# Altium schematic sheet Power.SchDoc
size A4; SheetNumber: 2; SheetTotal: 6
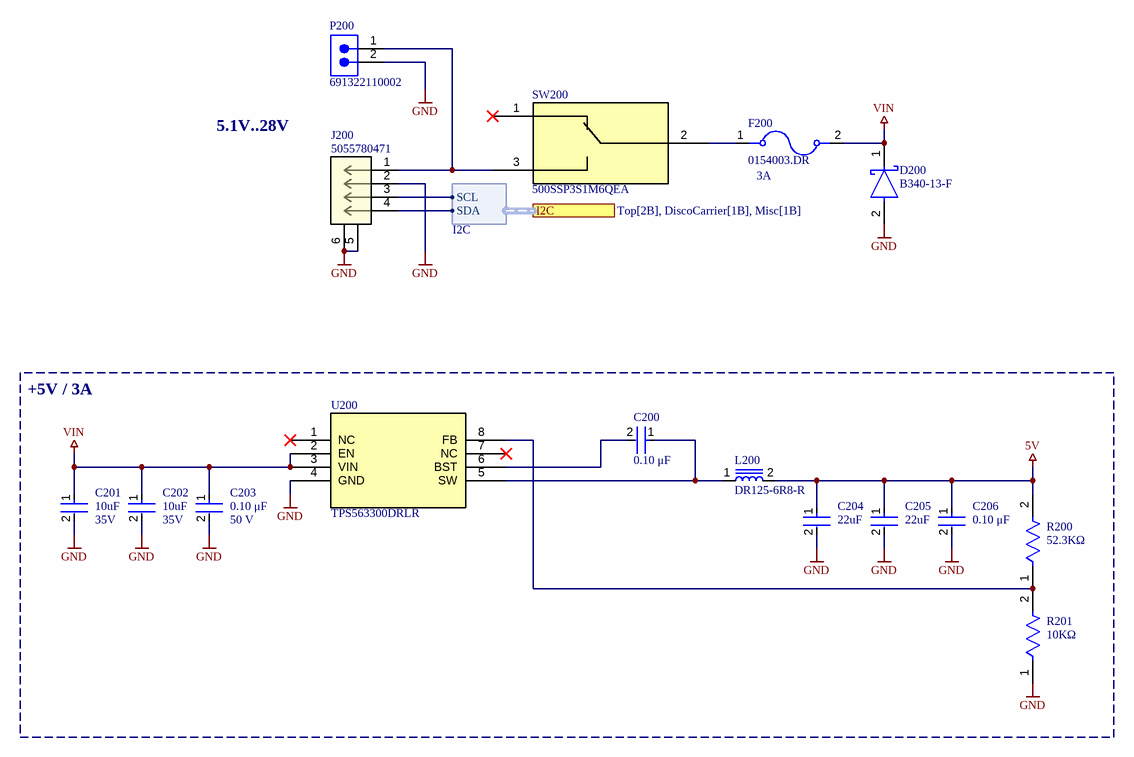
[diagram p0: Power.SchDoc]

## Parts
C200  value 0.10 μF  [FP-C0603C-CF-MFG]  (hidden comment: C0603C104M5RACTU)
C201  Capacitance: 10uF  Voltage Rating: 35V  [FP-GRT31C-0_2-IPC_A]  (hidden comment: GRT31CR6YA106KE01L)
C202  Capacitance: 10uF  Voltage Rating: 35V  [FP-GRT31C-0_2-IPC_A]  (hidden comment: GRT31CR6YA106KE01L)
C203  value 0.10 μF  Voltage Rating: 50 V  [FP-C0603C-CF-MFG]  (hidden comment: C0603C104M5RACTU)
C204  Capacitance: 22uF  [FP-GRM319-0_15-IPC_C]  (hidden comment: GRM319R61C226ME15D)
C205  Capacitance: 22uF  [FP-GRM319-0_15-IPC_C]  (hidden comment: GRM319R61C226ME15D)
C206  value 0.10 μF  [FP-C0603C-CF-MFG]  (hidden comment: C0603C104M5RACTU)
D200  B340-13-F  [FP-SMC-MFG]
F200  0154003.DR  value 3A  [FUSE_0154003.DR]
J200  5055780471  [CONN_505578_04_MOL]
L200  DR125-6R8-R  [INDM1250X1250X600]
P200  691322110002  [691322110002]
R200  value 52.3KΩ  [FP-RT0603-MFG]  (hidden comment: RT0603FRE0752K3L)
R201  value 10KΩ  [FP-RT0603-MFG]  (hidden comment: RT0603FRE0710KL)
SW200  500SSP3S1M6QEA  [SW3_500SSP3S1M6QEA_EWI]
U200  TPS563300DRLR  [SOT5X3-8_DRL_TEX]

## Blocks framed on the sheet
+5V / 3A: C200-C206 L200 R200 R201 U200

## Ports
I2C (harness I2C, see Top[2B], DiscoCarrier[1B], Misc[1B])

## Harnesses
I2C: SCL, SDA

## Nets
5V: C204.1 C205.1 C206.1 L200.2 R200.2
GND: C201.2 C202.2 C203.2 C204.2 C205.2 C206.2 D200.2(A) J200.2 J200.5 J200.6 P200.2 R201.1 U200.4(GND)
VIN: C201.1 C202.1 C203.1 D200.1(C) F200.2 U200.2(EN) U200.3(VIN)
NetC200_1: C200.1 L200.1 U200.5(SW)
NetC200_2: C200.2 U200.6(BST)
NetF200_1: F200.1 SW200.2
NetJ200_1: J200.1 P200.1 SW200.3
NetJ200_3: J200.3 ; port I2C.SCL
NetJ200_4: J200.4 ; port I2C.SDA
NetR200_1: R200.1 R201.2 U200.8(FB)

Not connected (* = marked no-connect by the designer): SW200 1*; U200 1(NC)* 7(NC)*

## Notes on the sheet
- 5.1V..28V
- Project:
- Board:
- Title:
- Size:
- Sheet:
- A4
- of
- Drawn by:
- Revision:
- Date:
- Variant:
- Source Engineers GmbH | CH-3012 Bern
- File:

## Library data of the parts
C200 C203 C206 = CMP-2006-03068-2: CAP CER 0.1UF 50V 20% X7R 0603; Manufacturer: KEMET; Material: Ceramic; Tolerance: 0.2; Temperature Coefficient: 30ppm/°C; Automotive Grade: Grade 1; Temperature Range High: +125°C; Device Class L3: Ceramic Capacitors; Manufacturer Part Number: C0603C104M5RACTU; Height: 0.87mm; Category: Cap; RoHS: TRUE; Digikey Description: CAP CER 0.1UF 50V 20% X7R 0603; ComponentLink2URL: https://api.kemet.com/component-edge/download/datasheet/C0603C100J5GACAUTO.pdf; Lead Free: Yes; Temperature Range Low: -55°C; Device Class L1: Passive Components; ComponentLink2Description: Datasheet; Temperature Characteristic: X7R; Automotive: Yes; Temperature: -55°C to +125°C; Octopart: https://octopart.com/c0603c104m5ractu-kemet-11855687; Device Class L2: Capacitors; Package: C0603C-CF; Mouser Description: Multilayer Ceramic Capacitors MLCC - SMD/SMT 50volts 0.1uF X7R 20%; Capacitance: 0.10 μF
  C200 C206: Voltage Rating: 50 V
C201 C202 = CMP-06035-017590-1: Multi-Layer Ceramic Capacitor 10uF 35V X5R ±10% 1206 Emboss T/R; Width: 0.063inch; Tolerance: 10%; Ratings: AEC-Q200; Packaging: Tape and Reel; Min Operating Temperature: -55°C; Case Code (Imperial): 1206; Case/Package: 1206; Max Operating Temperature: 85°C; Thickness: 0.071inch; Case Code (Metric): 3216; Mount: Surface Mount; Length: 0.126inch
C204 C205 = CMP-06035-037955-1: Chip Multilayer Ceramic Capacitors for General Purpose, 1206, 22uF, X5R, 15%, 20%, 16V; Weight: 0.001411oz; Case/Package: 1206; Mount: Surface Mount; Voltage Rating (DC): 16V; Case Code (Metric): 3216; Height: 0.85mm; Package Quantity: 4000; Resistor Type: Ceramic; Thickness: 0.037inch; Packaging: Tape and Reel; Dielectric: X5R; Tolerance: 20%; Case Code (Imperial): 1206; Width: 0.063inch; Termination: SMD/SMT; Voltage Rating: 16V; Length: 0.126inch; Min Operating Temperature: -55°C; Max Operating Temperature: 85°C
D200 = CMP-12790-000049-1: DIODE SCHOTTKY 40V 3A SMC; Manufacturer: Diodes Inc.; Max Surge Forward Current: 100A; Peak Reverse Current: 0.1mA; Max Junction Temp: +150°C; Value: 200pF; Standoff Height: 0.1mm; Temperature: -55°C to +150°C; Reverse Voltage: 40V; Max Repetitive Reverse Voltage: 40V; Forward Current: 3A; Device Class L2: Diodes; RoHS: TRUE; Footprint Url: https://www.diodes.com/assets/Package-Files/SMC.pdf; Digikey Description: DIODE SCHOTTKY 40V 3A SMC; Package: SMC; Category: Diode; ComponentLink2Description: Datasheet; Temperature Range High: +150°C; Lead Free: Yes; Mouser Description: Diode Schottky 40V 3A 2-Pin SMC T/R Diode Schottky 40V 3A 2-Pin SMC T/R; Manufacturer Part Number: B340-13-F; Octopart: https://octopart.com/b340-13-f-diodes+inc.-325814; Automotive: No; ComponentLink2URL: https://www.diodes.com/assets/Datasheets/ds30923.pdf; Capacitance: 200pF; Device Class L1: Discrete Semiconductors; Temperature Range Low: -55°C; Height: 2.5mm; Device Class L3: Schottky Diodes
F200 = 0154003.DR: Nano2 SMD FF submin fuse w/holder, 3A | Littelfuse 0154003.DR; MF: Littelfuse Inc.; SnapEDA_Link: https://www.snapeda.com/parts/0154003.DR/Littelfuse/view-part/?ref=snap; Package: SMD-2 Littelfuse; MP: 0154003.DR; Check_prices: https://www.snapeda.com/parts/0154003.DR/Littelfuse/view-part/?ref=eda; Supplier 1: DigiKey; Supplier Part Number 1: F1226CT-ND; Supplier 2: DigiKey; Supplier Part Number 2: F1226DKR-ND; Supplier 3: Mouser; Supplier Part Number 3: 576-0154003.DR
J200 = 5055780471: 2.00mm Pitch, Micro-Lock Plus PCB Header, Single Row, Right-Angle, Surface Mount, Matte Tin Plating, Positive Lock, 4 Circuits, Low-Halogen, Black; Manufacturer_Name: Molex Connector Corporation; Copyright: Copyright (C) 2025 Ultra Librarian. All rights reserved.; Manufacturer_Part_Number: 5055780471; Datasheet: https://www.molex.com/en-us/products/part-detail-pdf/5055780471?display=pdf; RefDes: RefDes; Type: Type; Supplier 1: DigiKey; Supplier Part Number 1: WM17949CT-ND; Supplier 2: DigiKey; Supplier Part Number 2: WM17949DKR-ND; Supplier 3: Mouser; Supplier Part Number 3: 538-505578-0471
L200 = DR125-6R8-R: Inductor Power Shielded Drum Core 3.084u(OCL)H/3.3uH 20% 100KHz Ferrite 9.26A 6.3mOhm DCR T/R; Package: None; Price: None; Value: *; MP: DR125-6R8-R; Availability: Unavailable; Supplier 1: DigiKey; Supplier Part Number 1: 513-1530-1-ND; Supplier 2: DigiKey; Supplier Part Number 2: 513-1530-6-ND; Supplier 3: DigiKey; Supplier Part Number 3: 513-1530-2-ND; Supplier 4: Mouser; Supplier Part Number 4: 704-DR125-6R8-R
P200 = CMP-1502-01791-3: NexarPartId: 18818346; Voltage Rating: 300V; Number of Contacts: 2; Gender: Male; Current: 10A; Number of Levels: 1; Pitch: 3.5052mm; Termination: Solder; Lead Pitch: 3.5mm; Width: 8.1mm; Length: 10.5mm; Number of Positions Per Level: 2; Number of Pins: 2; Max Operating Temperature: 105°C; RoHS: Compliant; Current Rating: 10A; Voltage: 300V; Mount: Through Hole; Color: Green; Min Operating Temperature: -40°C; Height: 7.4mm; Number of Rows: 1; Packaging: Box; Lead Free: Lead Free; REACH SVHC: Unknown; Contact Material: Brass
R200 = CMP-03412-024293-1: RES SMD 52.3K OHM 1% 1/10W 0603; Manufacturer: Yageo; Tolerance: 0.01; Power Rating: 0.1W; Voltage Rating: 75V; Temperature Coefficient: 50 ppm/°C; Series: RT; Manufacturer Part Number: RT0603FRE0752K3L; Device Class L2: Resistors; Digikey Description: RES SMD 52.3K OHM 1% 1/10W 0603; Mouser Description: Thin Film Resistors - SMD 1/10W 52.3K ohm 1% 50ppm; Height: 0.55mm; Footprint Url: http://www.yageo.com/exep/pages/download/literatures/PYu-R_Mount_10.pdf; RoHS: TRUE; Device Class L3: Chip SMD Resistors; Temperature Range Low: -55°C; Lead Free: Yes; Category: Res; Composition: Thin Film; Automotive: No; ComponentLink2URL: http://www.yageo.com/documents/recent/PYu-RT_1-to-0.01_RoHS_L_9.pdf; Temperature: -55°C to +155°C; Device Class L1: Passive Components; Ipc Land Pattern Name: RESC16080X45; Octopart: https://octopart.com/rt0603fre0752k3l-yageo-1195990; ComponentLink2Description: Datasheet; Package: RT0603; Resistance: 52.3KΩ; Temperature Range High: +155°C
R201 = CMP-03412-005349-1: RES SMD 10K OHM 1% 1/10W 0603; Manufacturer: Yageo; Temperature Coefficient: 50 ppm/°C; Power Rating: 0.1W; Tolerance: 0.01; Voltage Rating: 75V; RoHS: TRUE; Category: Res; Automotive: No; Digikey Description: RES SMD 10K OHM 1% 1/10W 0603; ComponentLink2Description: Datasheet; Octopart: https://octopart.com/rt0603fre0710kl-yageo-40009243; ComponentLink2URL: http://www.yageo.com/documents/recent/PYu-RT_1-to-0.01_RoHS_L_9.pdf; Device Class L3: Chip SMD Resistors; Device Class L1: Passive Components; Temperature Range High: +155°C; Height: 0.55mm; Composition: Thin Film; Ipc Land Pattern Name: RESC16080X45; Series: RT; Package: RT0603; Resistance: 10KΩ; Footprint Url: http://www.yageo.com/exep/pages/download/literatures/PYu-R_Mount_10.pdf; Temperature: -55°C to +155°C; Temperature Range Low: -55°C; Lead Free: Yes; Device Class L2: Resistors; Mouser Description: Thin Film Resistors - SMD 10K ohm 1% 1/10W; Manufacturer Part Number: RT0603FRE0710KL
SW200 = 500SSP3S1M6QEA: No Description Available; Manufacturer_Name: E-Switch; Copyright: Copyright (C) 2025 Ultra Librarian. All rights reserved.; Manufacturer_Part_Number: 500SSP3S1M6QEA; RefDes: RefDes; Type: Type; Supplier 1: DigiKey; Supplier Part Number 1: 500SSP3S1M6QEA-ND; Supplier 2: Mouser; Supplier Part Number 2: 612-500SSP3S1M6QEA
U200 = TPS563300DRLR: 3.8-V to 28-V Input, 3-A synchronous buck converter in SOT-583 package 8-SOT-5X3 -40 to 150; Manufacturer_Name: Texas Instruments; Copyright: Copyright (C) 2025 Ultra Librarian. All rights reserved.; Manufacturer_Part_Number: TPS563300DRLR; RefDes: RefDes; Type: Type; Supplier 1: DigiKey; Supplier Part Number 1: 296-TPS563300DRLRCT-ND; Supplier 2: DigiKey; Supplier Part Number 2: 296-TPS563300DRLRDKR-ND; Supplier 3: Mouser; Supplier Part Number 3: 595-TPS563300DRLR